# EAGLE design easyMySens-v010 (EAGLE 7.3.0)
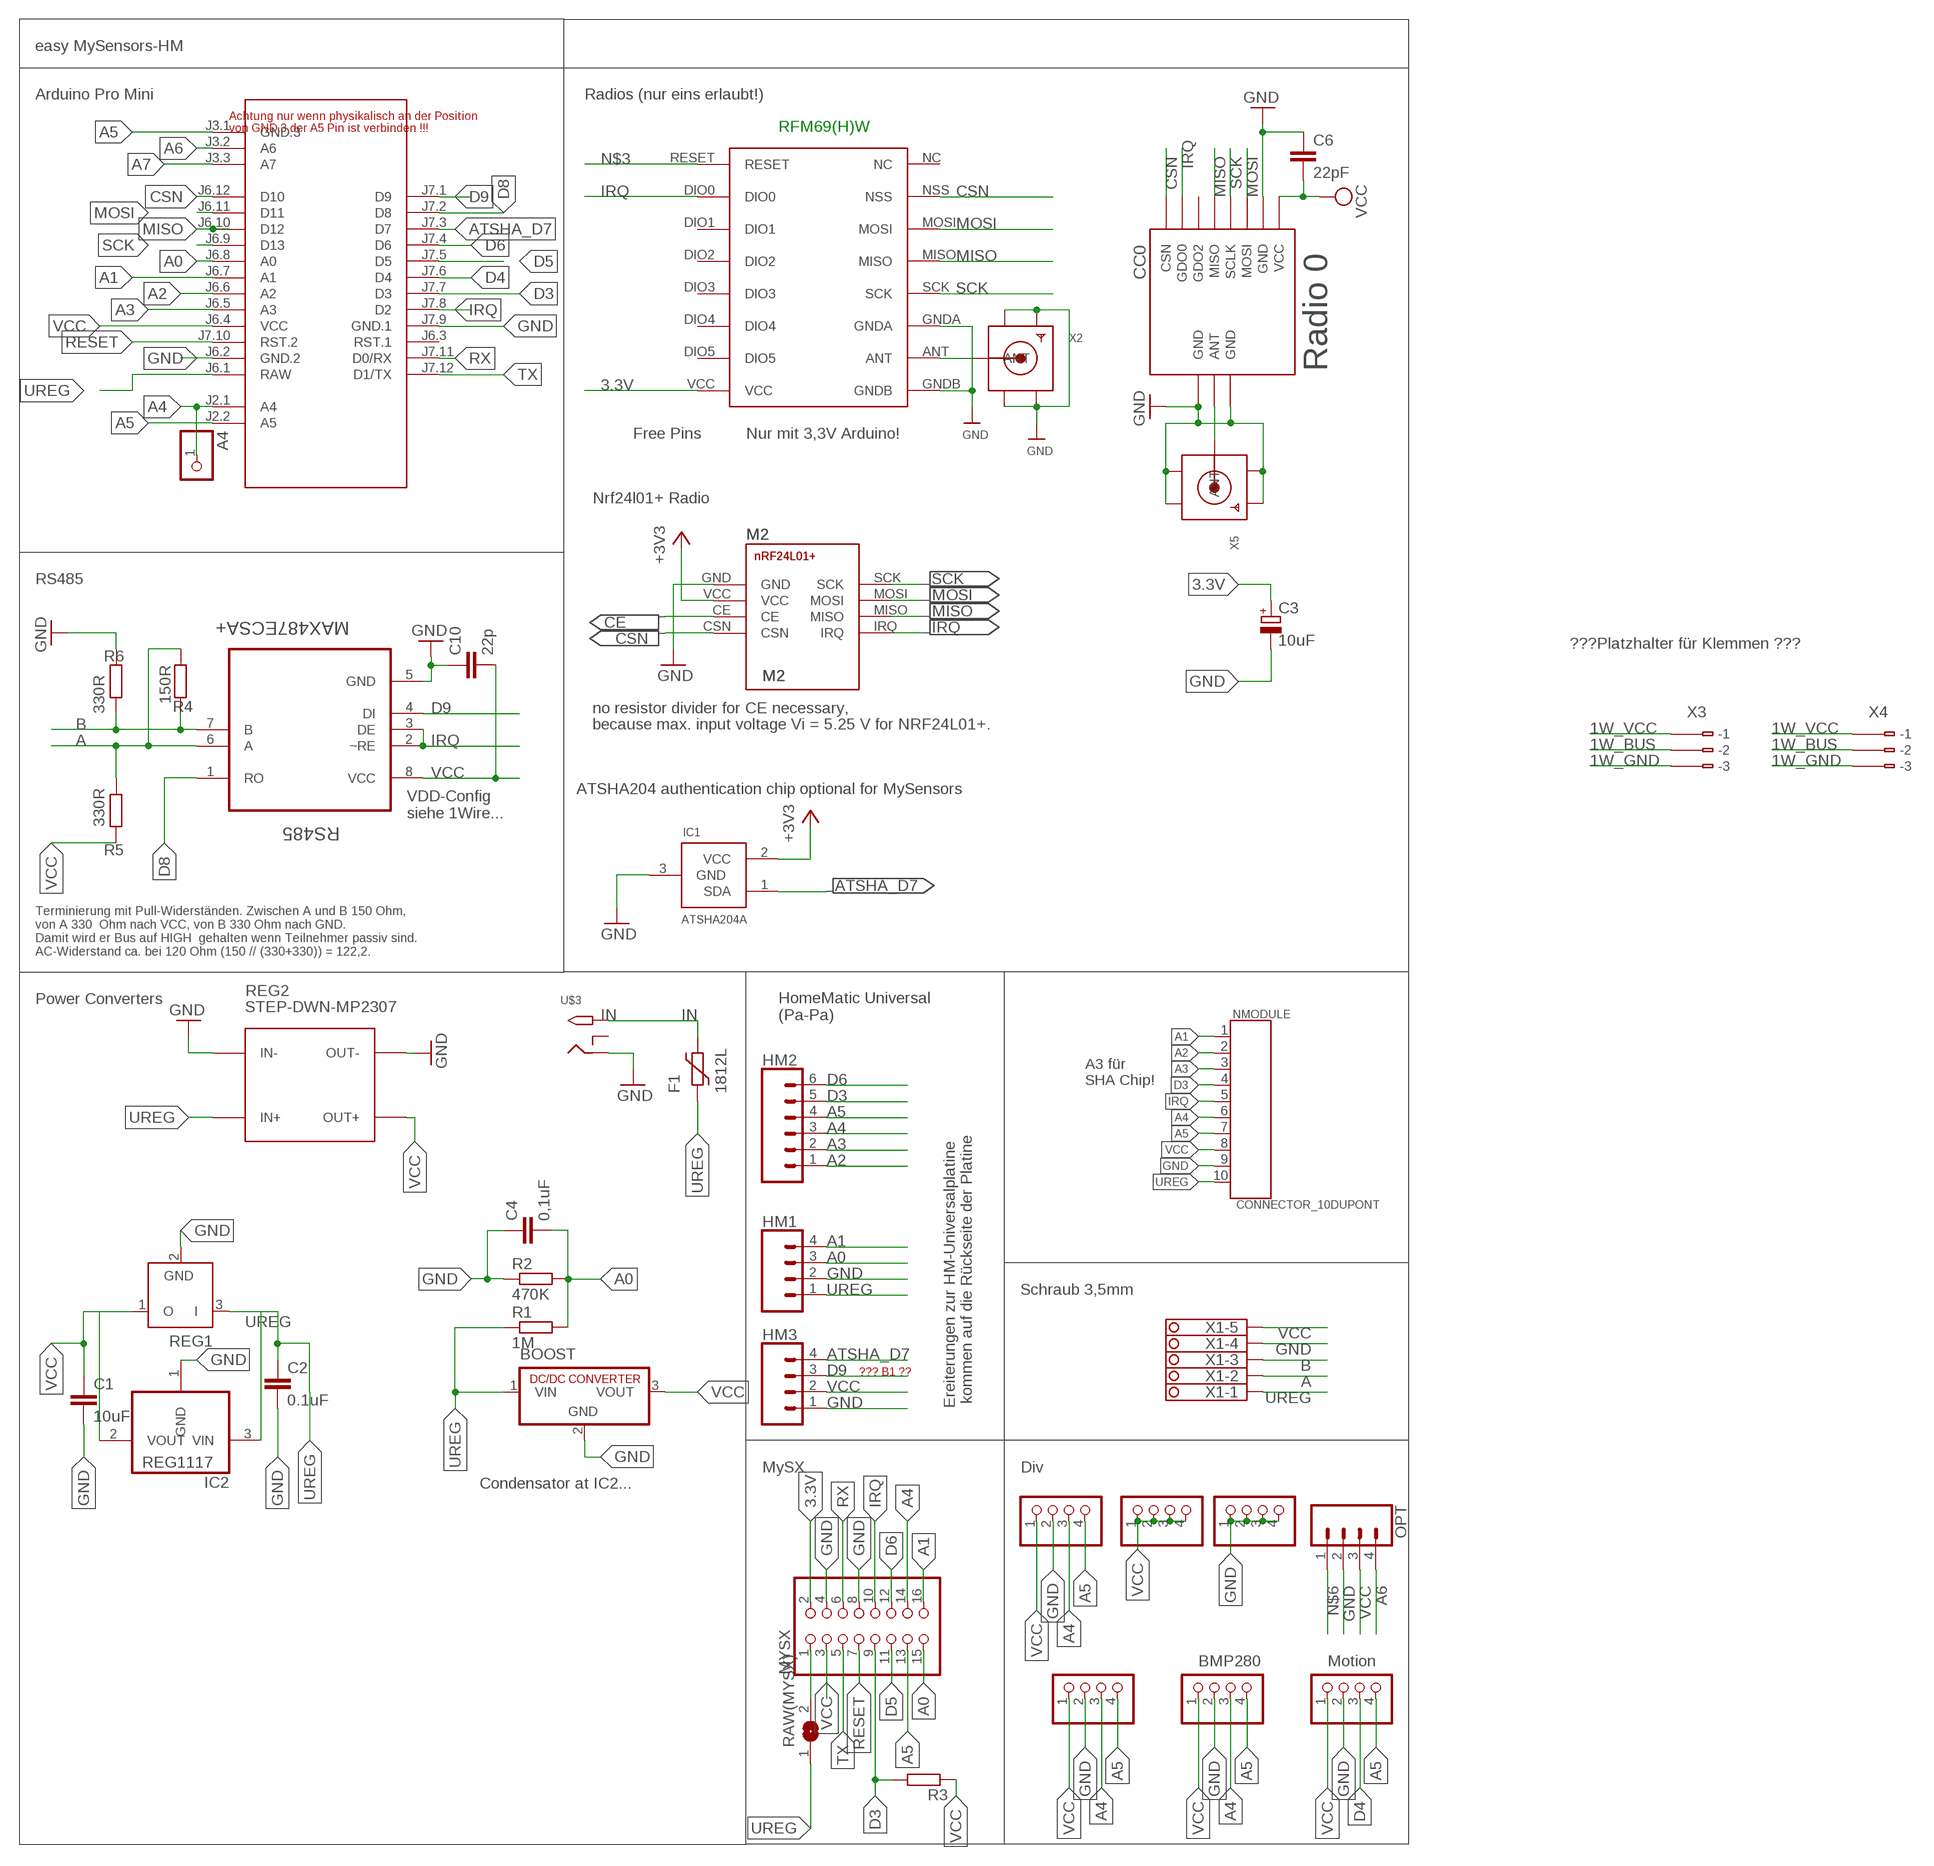
[diagram p0: schematic, sheet 1]

## Parts
A4  PINHD-1X1  [1X01]
BH1750  PINHD-1X04_2.54-S  [1X04-S]
BOOST  R-78C1.8-1.0  [SIP3]
C1  10uF  C-EUC1210  [C1210]
C2  0.1uF  C-EUC1206  [C1206]
C3  10uF  CPOL-EUSMCC  [SMC_C]
C4  0,1uF  C-EUC1206  [C1206]
C6  22pF  C-EUC0805  [C0805]
C10  22p  C-EUC0805  [C0805]
CC0  CC1101  CC1101_MODULE1SMD  [CC1101_MODULE1_SMD]
F1  1812L  [1812L]
HM1  CONN_04  [1X04]
HM2  CONN_06SILK_FEMALE_PTH  [1X06]
HM3  CONN_04  [1X04]
I2C-1  PINHD-1X04_2.54-S  [1X04-S]
I2C-2  PINHD-1X04_2.54-S  [1X04-S]
IC1  ATSHA204A  [SOT23]
IC2  REG1117  [SOT223]
JP1  PINHD-1X04_2.54-S  [1X04-S]
JP3  PINHD-1X04_2.54-S  [1X04-S]
M1  ARDUINO-PRO-MINI-3.3V#NP  [ARDUINO-PRO-MINI#NP]
M2  NRF24L01+SMD  [NRF24L01+SMD]
MOTION  PINHD-1X04_2.54-S  [1X04-S]
MYSX  PINHD-2X08_2.54  [2X08]
NMODULE  CONNECTOR_10DUPONT  [DUPONT_10]
OPT  CONN_04  [1X04]
R1  1M  R-EU_R0805  [R0805]
R2  470K  R-EU_R0805  [R0805]
R3  R-EU_R0805  [R0805]
R4  150R  R-EU_R0805  [R0805]
R5  330R  R-EU_R0805  [R0805]
R6  330R  R-EU_R0805  [R0805]
RAW(MYSX)  SJ  [SJ]
REG1  LP2950Z  [TO92]
REG2  STEP-DWN-MP2307  DC-DC-STEP-DOWN-MP2307  [DC-DC-STEP-DOWN-MP2307]
RFM69W  RFM69HW  [RFM]
RS485  MAX487ECSA+  [SOIC127P600X175-8N]
U$3  2.1MMJACKTHM  [PJ-102A]
X1  1751277  [1751277]
X2  SMACONNECTOR_EDGE  [SMA_EDGELAUNCH]
X3  CON_350-103  [CON_350-103]
X4  CON_350-103OHNE_RAND  [CON_350-103_O]
X5  SMACONNECTOR_EDGE  [SMA_EDGELAUNCH]

## Nets
1W_BUS: X3.B2(B-2) X4.B2(B-2)
1W_GND: X3.B3(B-3) X4.B3(B-3)
1W_VCC: X3.B1(B-1) X4.B1(B-1)
3.3V [Power]: C3.+ IC1.2(VCC) M2.VCC MYSX.2 RFM69W.VCC ; supply symbol labelled +3V3
A: R4.1 R5.2 RS485.6(A) X1.2
A0: C4.2 HM1.3 M1.J6.8(A0) MYSX.15 R1.2 R2.2
A1: HM1.4 M1.J6.7(A1) MYSX.16 NMODULE.1
A2: HM2.1 M1.J6.6(A2) NMODULE.2
A3: HM2.2 M1.J6.5(A3) NMODULE.3
A4: A4.1 BH1750.3 HM2.3 I2C-1.3 I2C-2.3 M1.J2.1(A4) MYSX.14 NMODULE.6
A5: BH1750.4 HM2.4 I2C-1.4 I2C-2.4 M1.J2.2(A5) M1.J3.1(GND.3) MOTION.4 MYSX.13 NMODULE.7
A6: M1.J3.2(A6) OPT.4
A7: M1.J3.3(A7)
ANT0: CC0.ANT X5.P(ANT)
ATSHA_D7: HM3.4 IC1.1(SDA) M1.J7.3(D7)
B: R4.2 R6.1 RS485.7(B) X1.3
CE: M2.CE
CSN: CC0.CSN M1.J6.12(D10) M2.CSN RFM69W.NSS
D3: HM2.5 M1.J7.7(D3) MYSX.9 NMODULE.4 R3.2
D4: M1.J7.6(D4) MOTION.3
D5: M1.J7.5(D5) MYSX.11
D6: HM2.6 M1.J7.4(D6) MYSX.12
D8: M1.J7.2(D8) RS485.1(RO)
D9: HM3.3 M1.J7.1(D9) RS485.4(DI)
GND [Power]: BH1750.2 BOOST.2(GND) C1.2 C2.2 C3.- C4.1 C6.1 C10.1 CC0.GND@0(GND) CC0.GND@1(GND) CC0.GND@2(GND) HM1.2 HM3.1 I2C-1.2 I2C-2.2 IC1.3(GND) IC2.1(GND) JP1.1 JP1.2 JP1.3 JP1.4 M1.J6.2(GND.2) M1.J7.9(GND.1) M2.GND MOTION.2 MYSX.4 MYSX.8 NMODULE.9 OPT.2 R2.1 R6.2 REG1.2(GND) REG2.IN- REG2.OUT- RFM69W.GNDA RFM69W.GNDB RS485.5(GND) U$3.RING X1.4 X2.GND@1(GND4) X2.GND@2(GND3) X2.GND@3(GND2) X2.GND@4(GND1) X5.GND@1(GND4) X5.GND@2(GND3) X5.GND@3(GND2) X5.GND@4(GND1)
IN [Power]: F1.P$2 U$3.TIP
IRQ: CC0.GDO0 M1.J7.8(D2) M2.IRQ MYSX.10 NMODULE.5 RFM69W.DIO0 RS485.2(~RE) RS485.3(DE)
MISO: CC0.MISO M1.J6.10(D12) M2.MISO RFM69W.MISO
MOSI: CC0.MOSI M1.J6.11(D11) M2.MOSI RFM69W.MOSI
N$1: MYSX.1 RAW(MYSX).2
N$3: RFM69W.RESET
N$6: OPT.1
N$16: RFM69W.ANT X2.P(ANT)
RESET: M1.J7.10(RST.2) MYSX.7
RX: M1.J7.11(D0/RX) MYSX.6
SCK: CC0.SCLK M1.J6.9(D13) M2.SCK RFM69W.SCK
TX: M1.J7.12(D1/TX) MYSX.5
UREG [Power]: BOOST.1(VIN) C2.1 F1.P$1 HM1.1 IC2.3(VIN) M1.J6.1(RAW) NMODULE.10 R1.1 RAW(MYSX).1 REG1.3(I) REG2.IN+ X1.1
VCC [Power]: BH1750.1 BOOST.3(VOUT) C1.1 C6.2 C10.2 CC0.VCC HM3.2 I2C-1.1 I2C-2.1 IC2.2(VOUT) JP3.1 JP3.2 JP3.3 JP3.4 M1.J6.4(VCC) MOTION.1 MYSX.3 NMODULE.8 OPT.3 R3.1 R5.1 REG1.1(O) REG2.OUT+ RS485.8(VCC) X1.5
Unconnected: CC0.GDO2 M1.J6.3(RST.1) RFM69W.DIO1 RFM69W.DIO2 RFM69W.DIO3 RFM69W.DIO4 RFM69W.DIO5 RFM69W.NC U$3.RING_SW X3.A1(-1) X3.A2(-2) X3.A3(-3) X4.A1(-1) X4.A2(-2) X4.A3(-3)

## Notes on the sheet
- easy MySensors-HM
- Arduino Pro Mini | Radios (nur eins erlaubt!)
- Achtung nur wenn physikalisch an der Position 
  von GND.3 der A5 Pin ist verbinden !!!
- RFM69(H)W
- Radio 0
- Free Pins | Nur mit 3,3V Arduino!
- Nrf24l01+ Radio
- RS485
- ???Platzhalter für Klemmen ???
- no resistor divider for CE necessary,
- because max. input voltage Vi = 5.25 V for NRF24L01+.
- ATSHA204 authentication chip optional for MySensors
- VDD-Config
  siehe 1Wire...
- Terminierung mit Pull-Widerständen. Zwischen A und B 150 Ohm,
  von A 330  Ohm nach VCC, von B 330 Ohm nach GND. 
  Damit wird er Bus auf HIGH  gehalten wenn Teilnehmer passiv sind.
  AC-Widerstand ca. bei 120 Ohm (150 // (330+330)) = 122,2.
- Power Converters
- HomeMatic Universal
  (Pa-Pa)
- A3 für 
  SHA Chip!
- Schraub 3,5mm
- ??? B1 ??
- Ereiterungen zur HM-Universalplatine
   kommen auf die Rückseite der Platine
- MySX | Div
- Condensator at IC2...
- BMP280 | Motion

## Library data of the parts
A4 = pinhead:PINHD-1X1: PIN HEADER
BH1750 I2C-1 I2C-2 JP1 JP3 MOTION = pinhead-2:PINHD-1X04: PIN HEADER
BOOST = dc-dc-converter:R-78C*-1.0: INNOLINE DC/DC-Converter 1.0 AMP SIP3 Single Output Source: Data sheet <http://www.mikrocontroller.net/attachment/150645/157764-da-01-en-DC_DC_WANDLER_R_78C5_0_1_0.pdf>
C1 C2 C4 C6 C10 = rcl:C-EU: CAPACITOR, European symbol
C3 = rcl:CPOL-EU: POLARIZED CAPACITOR, European symbol
CC0 = wireless:CC1101_MODULE1: CC1101 wireless module for 433/868 MHz (sold from Aliexpress). DIL version for mounting with pin header (and SMD soldering) and SMD only variant available.
F1 = ptc-littlefuse:1812L
HM1 HM3 OPT = SparkFun-Connectors:CONN_04: Multi connection point. Often used as Generic Header-pin footprint for 0.1 inch spaced/style header connections On any of the 0.1 inch spaced packages, you can populate with these: Break Away Headers - Straight <https://www.sparkfun.com/products/116> (PRT-00116) Break Away Male Headers - Right Angle <https://www.sparkfun.com/products/553> (PRT-00553) Female Headers <https://www.sparkfun.com/products/115> (PRT-00115) Break Away Headers - Machine Pin <https://www.sparkfun.com/products/117> (PRT-00117) Break Away Female Headers - Swiss Machine Pin <https://www.sparkfun.com/products/743> (PRT-00743) For SCREWTERMINALS and SPRING TERMINALS visit here: Screw Terimnals on SparkFun.com <https://www.sparkfun.com/search/results?term=Screw+Terminals> (5mm/3.5mm/2.54mm spacing) This device is also useful as a general connection point to wire up your design to another part of your project. Our various solder wires solder well into these plated through hole pads. Hook-Up Wire - Assortment (Stranded, 22 AWG) <https://www.sparkfun.com/products/11375> (PRT-11375) Hook-Up Wire - Assortment (Solid Core, 22 AWG) <https://www.sparkfun.com/products/11367> (PRT-11367) View the entire wire category on our website here <https://www.sparkfun.com/categories/141> Special notes: Molex polarized connector foot print use with SKU : PRT-08231 with associated crimp pins and housings. 1MM SMD Version SKU: PRT-10208; PROD_ID: CONN-09696
HM2 = SparkFun-Connectors:CONN_06: Multi connection point. Often used as Generic Header-pin footprint for 0.1 inch spaced/style header connections On any of the 0.1 inch spaced packages, you can populate with these: Break Away Headers - Straight <https://www.sparkfun.com/products/116> (PRT-00116) Break Away Male Headers - Right Angle <https://www.sparkfun.com/products/553> (PRT-00553) Female Headers <https://www.sparkfun.com/products/115> (PRT-00115) Break Away Headers - Machine Pin <https://www.sparkfun.com/products/117> (PRT-00117) Break Away Female Headers - Swiss Machine Pin <https://www.sparkfun.com/products/743> (PRT-00743) Arduino Stackable Header - 6 Pin <https://www.sparkfun.com/products/9280> (PRT-09280) For SCREWTERMINALS and SPRING TERMINALS visit here: Screw Terimnals on SparkFun.com <https://www.sparkfun.com/search/results?term=Screw+Terminals> (5mm/3.5mm/2.54mm spacing) This device is also useful as a general connection point to wire up your design to another part of your project. Our various solder wires solder well into these plated through hole pads. Hook-Up Wire - Assortment (Stranded, 22 AWG) <https://www.sparkfun.com/products/11375> (PRT-11375) Hook-Up Wire - Assortment (Solid Core, 22 AWG) <https://www.sparkfun.com/products/11367> (PRT-11367) View the entire wire category on our website here <https://www.sparkfun.com/categories/141>; PROD_ID: CONN-08437
IC1 = Sensor:ATSHA204A
IC2 = burr-brown:REG1117: 800mA and 1A Low Dropout (LDO) Positive Regulator 1.8V, 2.5V, 2.85V, 3.3V, 5V, and Adj; MPN: REG1117; OC_FARNELL: 1097566; OC_NEWARK: 14P6981
M1 = diy-modules:ARDUINO-PRO-MINI-*#NP: Arduino Pro Mini without programming pads
M2 = wireless:NRF24L01+: nRF24L01+ Transceiver Module
MYSX = pinhead-2:PINHD-2X08: PIN HEADER
NMODULE = TD-MySensors:CONNECTOR_10
R1-R6 = rcl:R-EU_: RESISTOR, European symbol
RAW(MYSX) = jumper:SJ: SMD solder JUMPER
REG1 = linear:LP2950: 100 mA, Low Power Low Dropout Voltage Regulator Source: http://www.onsemi.com/pub/Collateral/LP2950-D.PDF
REG2 = diy-modules:DC-DC-STEP-DOWN-MP2307: DC/DC Step-Down Regulator based on MP2307DN chip MP2307 datasheet available here: https://cdn-shop.adafruit.com/datasheets/MP2307_r1.9.pdf Click here to find device on ebay.com <http://www.ebay.com/sch/dc+dc+3a+mini+converter>
RFM69W = hoperf:RFM69HW
RS485 = Maxim_By_element14_Batch_1:MAX487ECSA+: Low-Power, Slew-Rate-Limited RS-485/RS-422 Transceivers; MPN: MAX487ECSA+; OC_FARNELL: 9724532; OC_NEWARK: 68K4803; PACKAGE: SOIC-8; SUPPLIER: Maxim
U$3 = adafruit:2.1MMJACK: 2.1mm x 5.5mm THM DC jack with internal switch. Digikey part #PJ-102A, 4UCON part #05537 2.1mm x 5.5mm SMT DC jack with internal switch. Digikey part #PJ-002A-SMT, 4UCON part #03267 By microbuilder.eu & adafruit.com
X1 = con-phoenix-350:1751277: MKDS 1/ 5-3,5 Printklemme Nennstrom: 10 A Bemessungsspannung: 160 V Raster: 3,5 mm Polzahl: 5 Montageart: Löten Anschlussart: Schraubanschluss Anschlussrichtung vom Leiter zur Platine: 0° Source: http://eshop.phoenixcontact.com .. 1751277.pdf; OC_FARNELL: unknown; OC_NEWARK: unknown
X2 X5 = adafruit:SMACONNECTOR: SMA Connector 90° DIP SMA Connector, 50 Ohm (4UConnector: 07259)
X3 = my:CON_350-103: KF250-3.5 3p; MPN: 233-103; OC_FARNELL: unknown; OC_NEWARK: 28K9045
X4 = my:CON_350-103: KF250-3.5 3p

## Net classes
0 default: width 0.305 mm
1 Power: width 0.508 mm

## Board
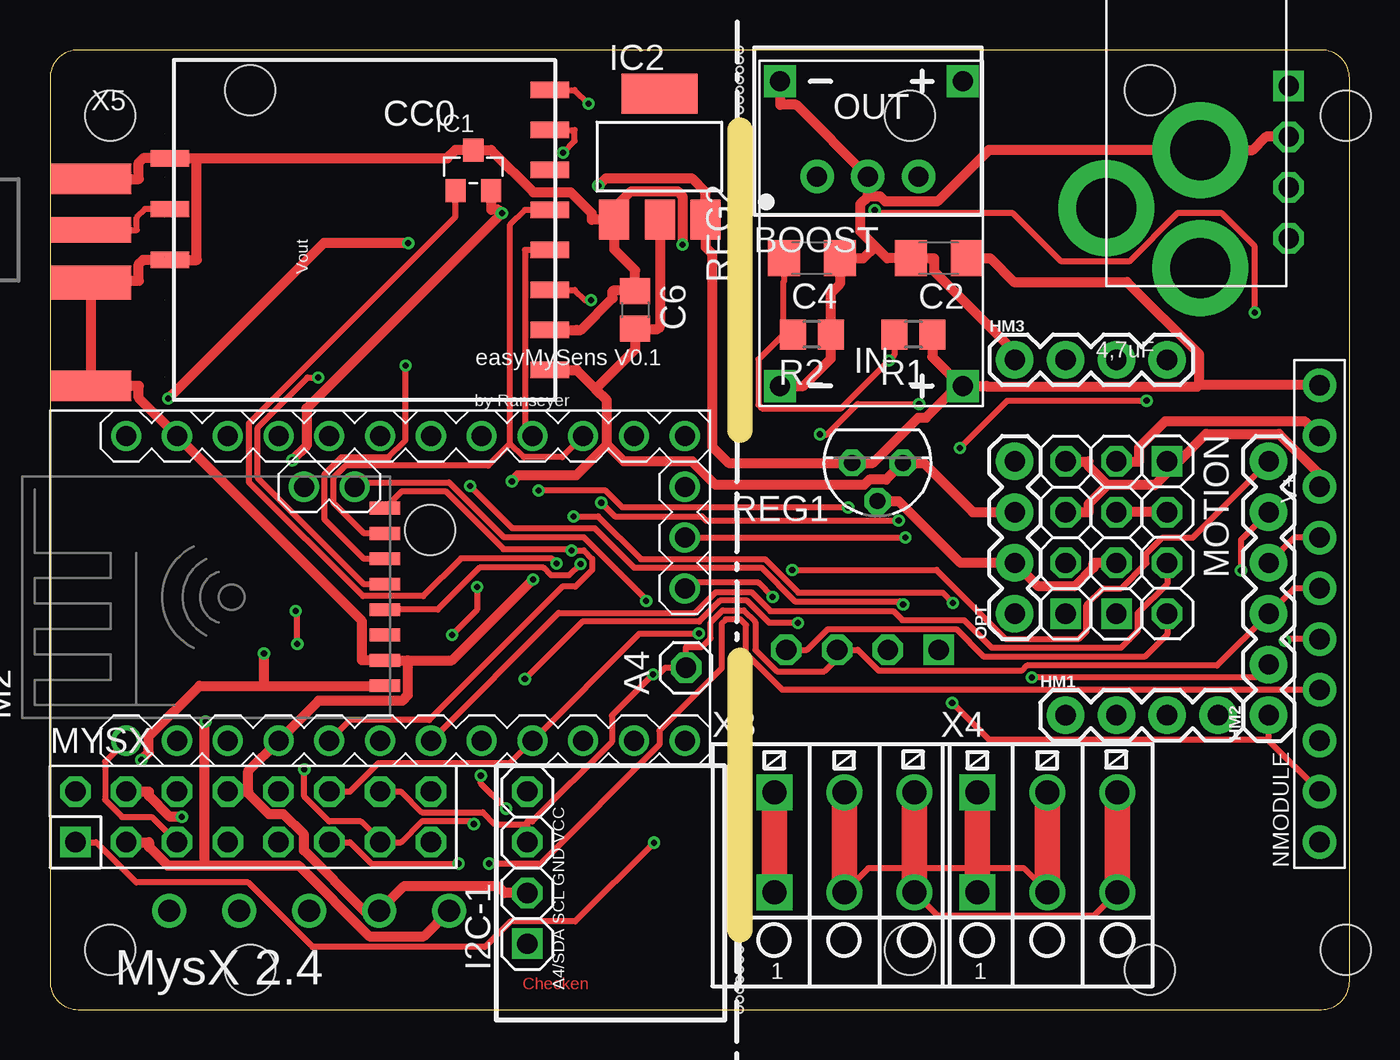
[diagram p1: board, top side]
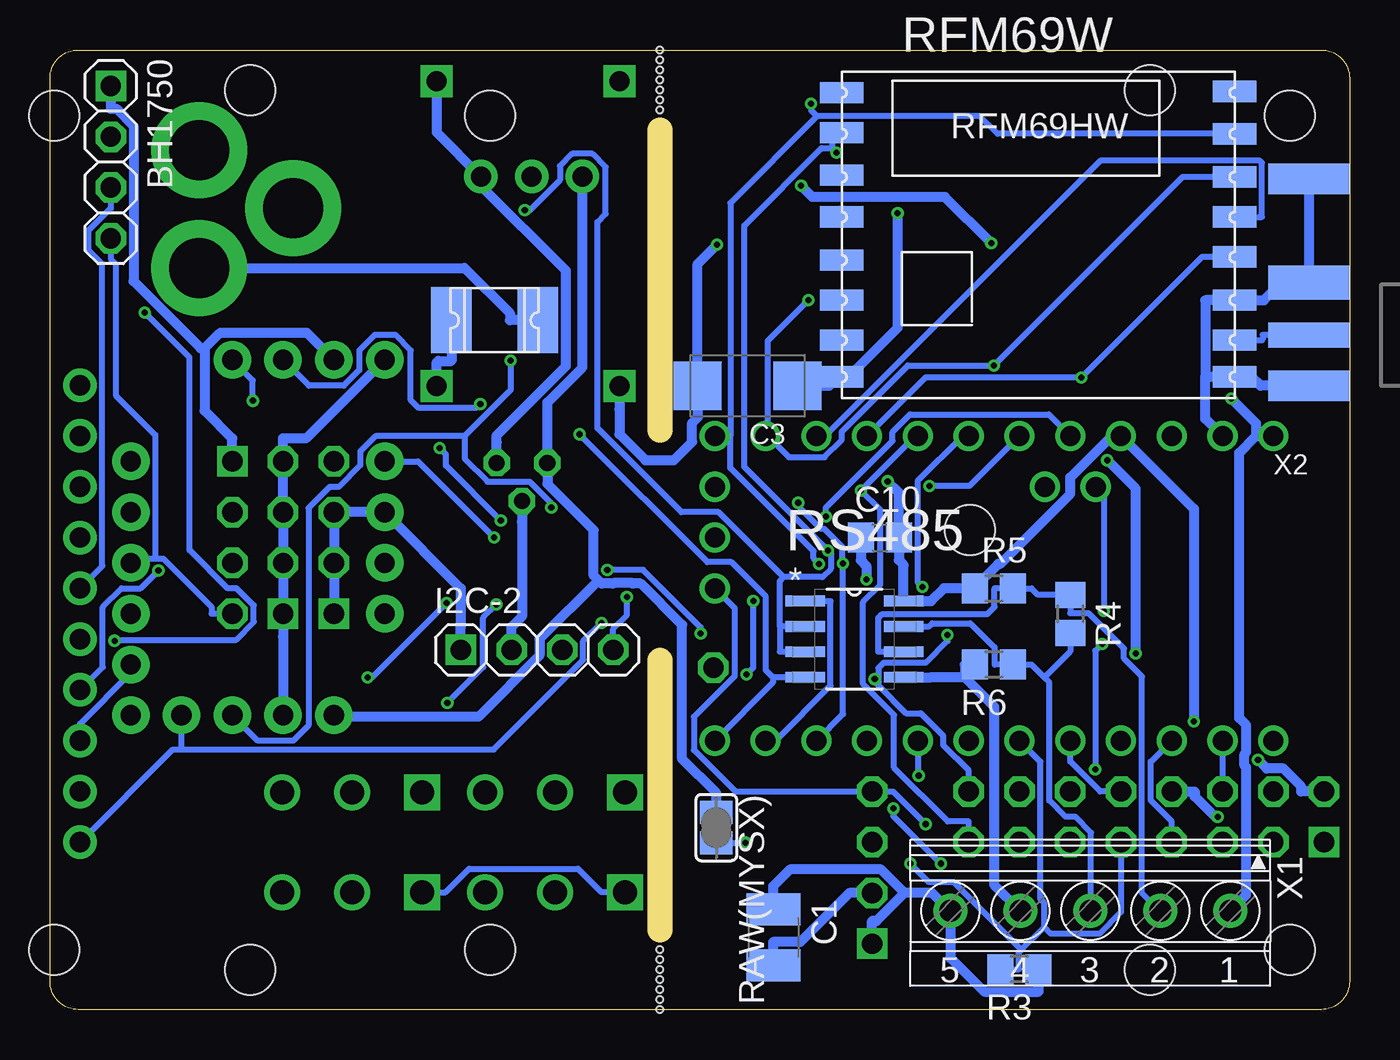
[diagram p2: board, bottom side, seen from below]

Size 65 x 48 mm. Coordinates in mm from the lower left corner, seen from the top.
Outline: 0,46.59 0,1.41 arc90 1.41,0 63.59,0 arc90 65,1.41 65,46.59 arc90 63.59,48 1.41,48 arc90 0,46.59
Copper layers (1*16): Top 0.035mm / dielectric 1.5mm / Bottom 0.035mm
Design rules "dirt_cheap_dirty_boards.v1": minimum track width 5mil, minimum drill 12mil, track to track 5mil, track to pad 5mil, pad to pad 5mil, via to via 5mil, smd to smd 0mil, copper to edge 10mil, drill to drill 10mil, minimum pad ring 10mil, minimum via ring 6mil, stop-mask expansion 2mil, vias tented up to drill 25mil, thermal gap 10mil
Holes 2.5 mm at 19,24 3,3 3,44.7 64.8,44.7 43,3 64.8,3 43,44.7 10,2 55,2 10,46 55,46
Holes 0.3 mm at 34.5,3 34.5,2.5 34.5,2 34.5,1.5 34.5,1 34.5,0.5 34.5,45 34.5,45.5 34.5,46 34.5,46.5 34.5,47 34.5,47.5 34.5,48 34.5,0
tRestrict: 20 lines
bRestrict: 19 lines
Milling: 2 lines

### Footprints (pad centres in the part's own frame; a part is rotated, then mirrored left to right if it is on the bottom)
1X01 = drill 1.016 octagon: 1 0,0
1X04-S = drill 1.016 square: 1 -3.81,0 | drill 1.016 octagon: 2 -1.27,0; 3 1.27,0; 4 3.81,0
SIP3 = drill 1 pad 1.676: 1 -2.54,0; 2 0,0; 3 2.54,0
C1210 = smd 1.6 x 2.7: 1 -1.4,0; 2 1.4,0
C1206 = smd 1.6 x 1.8: 1 -1.4,0; 2 1.4,0
SMC_C = smd 2.4 x 2.4: + -2.5,0; - 2.5,0
C0805 = smd 1.3 x 1.5: 1 -0.95,0; 2 0.95,0
CC1101_MODULE1_SMD = smd 1.93 x 0.813: ANT 19,5.96; CSN 0,0; GDO0 0,2; GDO2 0,4; GND@0 0,12; GND@1 19,8.5; GND@2 19,3.42; MISO 0,6; MOSI 0,10; SCLK 0,8; VCC 0,14
1812L = smd 2.03 x 3.3: P$1 -2.16,0; P$2 2.16,0
1X04 = drill 1.016 pad 1.88: 1 0,0; 2 2.54,0; 3 5.08,0; 4 7.62,0
1X06 = drill 1.016 pad 1.88: 1 0,0; 2 2.54,0; 3 5.08,0; 4 7.62,0; 5 10.16,0; 6 12.7,0
SOT23 = smd 1.016 x 1.143: 1 -0.889,-1.016; 2 0.889,-1.016; 3 0,1.016
SOT223 = smd 1.499 x 2.007: 1 -2.261,-3.15; 2 0.025,-3.15; 3 2.311,-3.15 | smd 3.81 x 2.007: 4 0,3.15
ARDUINO-PRO-MINI#NP = drill 1: J2.1 -1.27,5.08; J2.2 -3.81,5.08; J3.1 15.24,0; J3.2 15.24,2.54; J3.3 15.24,5.08; J6.1 -12.7,7.62; J6.2 -10.16,7.62; J6.3 -7.62,7.62; J6.4 -5.08,7.62; J6.5 -2.54,7.62; J6.6 0,7.62; J6.7 2.54,7.62; J6.8 5.08,7.62; J6.9 7.62,7.62; J6.10 10.16,7.62; J6.11 12.7,7.62; J6.12 15.24,7.62; J7.1 15.24,-7.62; J7.2 12.7,-7.62; J7.3 10.16,-7.62; J7.4 7.62,-7.62; J7.5 5.08,-7.62; J7.6 2.54,-7.62; J7.7 0,-7.62; J7.8 -2.54,-7.62; J7.9 -5.08,-7.62; J7.10 -7.62,-7.62; J7.11 -10.16,-7.62; J7.12 -12.7,-7.62
NRF24L01+SMD = smd 0.635 x 1.524: CE -1.575,-7.861; CSN -0.305,-7.861; GND -2.845,-7.861; IRQ 4.775,-7.861; MISO 3.505,-7.861; MOSI 2.235,-7.861; SCK 0.965,-7.861; VCC -4.115,-7.861
2X08 = drill 1.016 square: 1 -8.89,-1.27 | drill 1.016 octagon: 2 -8.89,1.27; 3 -6.35,-1.27; 4 -6.35,1.27; 5 -3.81,-1.27; 6 -3.81,1.27; 7 -1.27,-1.27; 8 -1.27,1.27; 9 1.27,-1.27; 10 1.27,1.27; 11 3.81,-1.27; 12 3.81,1.27; 13 6.35,-1.27; 14 6.35,1.27; 15 8.89,-1.27; 16 8.89,1.27
DUPONT_10 = drill 1.016 pad 1.676: 1 1.27,1.27; 2 3.81,1.27; 3 6.35,1.27; 4 8.89,1.27; 5 11.43,1.27; 6 13.97,1.27; 7 16.51,1.27; 8 19.05,1.27; 9 21.59,1.27; 10 24.13,1.27
R0805 = smd 1.3 x 1.5: 1 -0.95,0; 2 0.95,0
SJ = smd 1.168 x 1.6: 1 -0.762,0; 2 0.762,0
TO92 = drill 0.813 octagon: 1 -1.27,0; 2 0,1.905; 3 1.27,0
DC-DC-STEP-DOWN-MP2307 = drill 1 pad 1.6 square: IN+ -7.62,-4.572; IN- -7.62,4.572; OUT+ 7.62,-4.572; OUT- 7.62,4.572
RFM = smd 2.184 x 1.067: ANT 19.651,2.889; DIO0 0,13.27; DIO1 0,11.143; DIO2 0,9.047; DIO3 0,6.889; DIO4 0,4.889; DIO5 0,2.889; GNDA 19.651,4.889; GNDB 19.651,1.048; MISO 19.651,9.047; MOSI 19.651,11.047; NC 19.651,15.334; NSS 19.651,13.206; RESET 0,15.27; SCK 19.651,7.048; VCC 0,1.048
SOIC127P600X175-8N = smd 1.981 x 0.533: 1 -2.464,1.905; 2 -2.464,0.635; 3 -2.464,-0.635; 4 -2.464,-1.905; 5 2.464,-1.905; 6 2.464,-0.635; 7 2.464,0.635; 8 2.464,1.905
PJ-102A = drill 3 pad 4.8: RING 0.1,-3.39; RING_SW -4.6,-6.29; TIP 0.1,-9.29
1751277 = drill 1.1 pad 1.7: 1 -7,-0.1; 2 -3.5,-0.1; 3 0,-0.1; 4 3.5,-0.1; 5 7,-0.1
SMA_EDGELAUNCH = smd 4.064 x 1.524: GND@1 2.032,-2.54; GND@2 2.032,2.54 | smd 4.064 x 1.524 bottom: GND@3 2.032,2.54; GND@4 2.032,-2.54 | smd 4.064 x 1.27: P 2.032,0
CON_350-103 = drill 1.2 square: A1 -2.5,2.5; B1 -2.5,-2.5 | drill 1.2: A2 1,2.5; A3 4.5,2.5; B2 1,-2.5; B3 4.5,-2.5
CON_350-103_O = drill 1.2 square: A1 -2.5,2.5; B1 -2.5,-2.5 | drill 1.2: A2 1,2.5; A3 4.5,2.5; B2 1,-2.5; B3 4.5,-2.5

### Placement (x,y rotation side)
A4  31.82,17.1 90 top
BH1750  61.96,42.39 270 bottom
BOOST  40.91,41.67 0 top
C1  28.81,3.6 270 bottom
C2  44.45,37.58 180 top
C3  30.11,31.2 180 bottom
C4  38.1,37.58 180 top
C6  29.27,35 270 top
C10  23.5,23.61 0 bottom
CC0  25,46 180 top
F1  42.76,34.48 0 bottom
HM1  50.8,14.72 0 top
HM2  60.96,14.72 90 top
HM3  48.26,32.5 0 top
I2C-1  23.88,7.1 90 top
I2C-2  40.64,17.99 0 bottom
IC1  21.18,41.97 0 top
IC2  30.48,42.66 0 top
JP1  53.34,23.61 90 top
JP3  50.8,23.61 90 top
M1  16.51,21.07 0 top
M2  8.89,20.31 90 top
MOTION  55.88,23.61 270 top
MYSX  10.16,9.64 0 top
NMODULE  64.77,7.1 90 top
OPT  48.26,19.8 90 top
R1  43.18,33.77 180 top
R2  38.1,33.77 180 top
R3  16.51,2.02 180 bottom
R4  13.97,19.8 270 bottom
R5  17.78,21.07 0 bottom
R6  17.78,17.26 180 bottom
RAW(MYSX)  31.68,9.1 270 bottom
REG1  41.39,27.34 180 top
REG2  41.09,38.81 90 top
RFM69W  25.4,30.59 0 bottom
RS485  24.77,18.53 0 bottom
U$3  57.44,46.39 0 top
X1  12.97,4.83 180 bottom
X2  0,33.74 180 bottom
X3  38.73,8.37 0 top
X4  48.9,8.37 0 top
X5  0,39 0 top

### Tracks (layer width: path | path; a pad name or v marks a point on that pad's centre or on a via)
1W_BUS
  Top 0.305: X4.B2 48.7,7.06 40.93,7.06 X3.B2
1W_GND
  Top 0.305: X4.B3 52.22,4.69 44.41,4.69 X3.B3
1W_VCC
  Bottom 0.305: X3.B1 37.41,5.87 38.59,7.05 44.04,7.05 45.22,5.87 X4.B1
3.3V  (via drill 0.3 pad 0.61)
  Top 0.508: 10.7,16.19 M2.VCC | v4.57,12.49 4.95,12.86 4.95,13.65 7.49,16.19 10.7,16.19 | v10.7,17.81 10.7,16.19 | v12.12,27.48 12.84,28.19 12.84,30.07 v22.61,39.84 22.43,40.01 22.06,40.01 IC1.2
  Bottom 0.508: C3.+ 26.03,31.2 25.58,31.64 RFM69W.VCC 25.06,31.64 22.61,34.1 v22.61,39.84 | MYSX.2 2.41,10.91 2.41,11.16 3.31,12.05 4.14,12.05 v4.57,12.49 | v10.7,17.81 10.7,26.05 v12.12,27.48
A
  Bottom 0.305: X1.2 10.38,5.84 10.38,16.66 11.28,17.56 11.28,18.06 13.04,19.82 13.97,19.82 R4.1 15,20.75 15.58,20.75 15.9,21.07 R5.2 17.07,21.07 17.76,21.07 17.76,20.14 18.12,19.78 23.39,19.78 23.57,19.59 23.57,17.9 RS485.6
A0  (via drill 0.3 pad 0.61)
  Top 0.305: v39.92,25.12 28.64,25.12 27.79,25.96 v24.43,25.96 | 36.69,33.77 35.43,32.52 35.43,30.26 35.62,30.07 39.56,30.07 v41.96,32.47 42.23,32.74 R1.2 | 36.69,33.77 36.69,36.39 36.7,36.4 C4.2 | R2.2 36.69,33.77
  Bottom 0.305: 44.26,28.68 48.72,28.68 49.48,27.92 49.48,27.22 50.55,26.15 51.01,26.15 52.07,25.09 52.07,14.21 52.83,13.45 54.61,13.45 HM1.3 | v41.96,32.47 41.96,30.99 44.26,28.68 | 44.26,28.68 44.26,27.55 43.12,26.4 41,26.4 39.92,25.32 v39.92,25.12 | M1.J6.8 21.7,28.69 v24.43,25.96 23.48,25 23.48,21.24 24.34,20.38 24.34,16.29 22.78,14.73 22.78,12.1 20.09,9.41 19.05,9.41 MYSX.15
A1  (via drill 0.3 pad 0.61)
  Top 0.305: v37.41,19.34 35.98,19.34 34.87,20.45 33.52,20.45 32.47,19.41 26.63,19.41 v23.75,16.53 | v21.36,21.14 21.36,19.99 v20.11,18.74
  Bottom 0.305: 58.42,13.01 42.81,13.01 38.33,17.49 38.33,18.43 v37.41,19.34 | M1.J6.7 19.34,28.69 21.6,26.43 21.6,21.38 v21.36,21.14 | 58.42,13.01 HM1.4 | NMODULE.1 58.86,13.01 58.42,13.01 | 23.57,16.53 23.57,16.21 22.19,14.82 21.44,14.82 20.33,13.71 20.33,13.23 19.05,11.95 MYSX.16 | v20.11,18.74 20.11,18.43 21.2,17.35 23.31,17.35 23.57,17.09 23.57,16.53 | v23.75,16.53 23.57,16.53
A2  (via drill 0.3 pad 0.61)
  Top 0.305: v21.01,26.19 23.12,24.08 27.25,24.08 29.22,22.1 35.58,22.1 37.26,20.42 42.51,20.42 v42.67,20.26 | 60.96,13.48 46.99,13.48 v45.13,15.34 | NMODULE.2 60.96,13.45 60.96,13.48 | 60.96,13.48 HM2.1
  Bottom 0.305: v45.13,15.34 43.33,17.13 43.33,19.6 v42.67,20.26 | M1.J6.6 19.01,26.19 v21.01,26.19
A3  (via drill 0.3 pad 0.61)
  Top 0.305: v26.19,24.67 27.43,24.67 29.55,22.53 35.76,22.53 37.44,20.85 44.65,20.85 v45.16,20.34 | HM2.2 60.32,16.62 v49.11,16.62
  Bottom 0.305: v45.16,20.34 48.89,16.62 v49.11,16.62 | v26.19,24.67 26.19,25.11 22.86,28.44 22.86,28.89 21.98,29.77 15.05,29.77 M1.J6.5 | NMODULE.3 63.5,14.29 60.96,16.83 HM2.2
A4  (via drill 0.3 pad 0.61)
  Top 0.305: 39.8,17.99 38.73,16.92 36.35,16.92 35.28,17.99 35.28,19.38 34.7,19.97 33.64,19.97 33.04,19.37 33.04,18.56 32.62,18.14 31.82,18.14 A4.1 30.77,17.1 30.44,16.77 v30.16,16.77 28.1,14.71 28.1,13.4 24.12,9.41 23.88,9.41 23.88,9.27 | M1.J2.1 15.46,26.37 19.96,26.37 22.69,23.64 26.7,23.64 29.82,20.51 v29.82,20.44 | MYSX.14 17.55,10.91 18.59,9.87 21.65,9.87 22.25,9.27 23.88,9.27 | I2C-1.3 23.88,9.27 | NMODULE.6 62.23,21.07 HM2.3 58.36,17.2 48.87,17.2 48.61,16.94 41.46,16.94 40.41,17.99 39.89,17.99 39.8,17.99 | I2C-2.3 39.8,17.99
  Bottom 0.305: v30.16,16.77 29.82,17.11 v29.82,20.44 | BH1750.3 61.96,40.08 63.05,38.98 63.05,37.97 62.38,37.29 62.38,22.19 NMODULE.6
A5  (via drill 0.3 pad 0.61)
  Top 0.305: 16.59,8.37 15.55,9.41 13.97,9.41 12.72,10.66 v12.72,12.02 | v12.37,18.29 12.37,19.86 v12.29,19.94 | 16.59,8.37 16.68,8.37 16.77,8.37 17.55,8.37 18.62,9.44 21.04,9.44 v21.2,9.28 | MYSX.13 16.59,8.37 | v36.15,20.64 35.43,21.36 32.04,21.36 M1.J3.1 | I2C-2.4 37.87,17.99 38.91,19.03 45.33,19.03 46.69,17.67 54.8,17.67 55.88,18.76 MOTION.4 | NMODULE.7 62.23,23.61 HM2.4
  Bottom 0.305: M1.J3.1 30.76,20.08 30.76,16.67 32.79,14.64 32.79,12.98 30.72,10.91 I2C-1.4 22.83,10.91 v21.2,9.28 | v12.37,18.29 12.72,17.94 v12.72,12.02 | M1.J2.2 12.29,25.74 v12.29,19.94 | I2C-2.4 36.83,19.03 36.15,19.72 v36.15,20.64 | 59.73,22.55 59.33,22.55 56.92,20.14 56.92,19.8 MOTION.4 | HM2.4 60.75,22.55 59.73,22.55 | 59.73,22.55 59.73,28.74 61.7,30.71 61.7,37.28 61.96,37.54 BH1750.4
A6  (via drill 0.3 pad 0.61)
  Top 0.305: M1.J3.2 v42.79,23.61
  Bottom 0.305: OPT.4 46.6,27.42 v42.79,23.61
ANT0
  Top 0.305: X5.P 4.34,39 4.34,39.63 4.75,40.04 CC0.ANT
ATSHA_D7  (via drill 0.3 pad 0.61)
  Top 0.305: v27.57,25.35 28.26,24.67 32.61,24.67 32.82,24.46 v42.45,24.46 | v45.51,28.09 47.88,30.45 v54.85,30.45 | v25.34,22.31 25.09,22.57 20.56,22.57 18.67,20.68 15.66,20.68 9.96,26.37 9.96,29.33 20.29,39.66 IC1.1
  Bottom 0.305: v27.57,25.35 27.57,25.17 26.44,24.04 26.27,24.04 25.38,23.15 25.38,22.35 v25.34,22.31 25.34,14.78 M1.J7.3 | v42.45,24.46 45.19,27.2 45.19,27.77 | 45.19,27.77 | 45.19,27.77 v45.51,28.09 | v54.85,30.45 54.85,31.47 HM3.4
B
  Bottom 0.305: 15.27,16.62 15.9,17.26 R6.1 17.76,17.26 17.76,18.12 18.97,19.32 20.87,19.32 21.03,19.16 RS485.7 | X1.3 12.93,4.97 12.93,8.84 13.72,9.64 14.21,9.64 15.02,10.45 15.02,16.38 15.27,16.62 | 15.27,16.62 13.97,17.92 R4.2
CSN  (via drill 0.3 pad 0.61)  (1 unrouted)
  Top 0.305: v26.53,22.3 25.95,21.71 25.07,21.71 24.68,22.1 21.5,22.1 19.39,20 M2.CSN | v26.94,45.31 26.25,46 CC0.CSN
  Bottom 0.305: v26.53,22.3 26.81,22.57 26.81,22.93 30.97,27.09 30.97,28.69 | 26.64,44.68 30.97,40.35 30.97,28.69 | 30.97,28.69 M1.J6.12 | RFM69W.NSS 17.6,43.8 18.48,44.68 26.64,44.68 | v26.94,45.31 26.94,44.98 26.64,44.68
D3  (via drill 0.3 pad 0.61)
  Top 0.305: NMODULE.4 36.63,15.99 34.81,17.8 34.81,19.23 34.53,19.52 33.8,19.52 33.59,19.31 33.59,17.07 30.48,13.96 30.48,13.25 24.52,7.3 v21.96,7.3 | HM2.5 59.57,23.49 v59.57,21.97
  Bottom 0.305: 16.4,2.99 19.79,6.37 21.03,6.37 v21.96,7.3 | 16.4,2.99 15.27,4.12 | 16.4,2.99 16.53,2.86 16.53,2.02 R3.2 | 15.27,4.12 15.27,5.33 15.45,5.51 15.45,12.39 M1.J7.7 | 15.27,4.12 14.95,3.8 12.49,3.8 11.43,4.86 11.43,7.33 MYSX.9 | NMODULE.4 62.36,17.13 62.36,20.13 61.42,21.07 60.47,21.07 v59.57,21.97
D4
  Top 0.305: M1.J7.6 25.44,19.84 32.27,19.84 33.31,20.88 35.08,20.88 36.03,19.93 42.18,19.93 42.62,19.48 45.72,19.48 47.09,18.11 53.58,18.11 54.41,18.94 54.41,19.83 55.88,21.3 MOTION.3
D5  (via drill 0.3 pad 0.61)
  Top 0.305: MYSX.11 15.01,8.37 16.08,7.3 v20.44,7.3 | v22.82,10.05 21.55,11.32 v21.55,11.7
  Bottom 0.305: v22.82,10.05 22.82,9.67 v20.44,7.3 | M1.J7.5 21.59,11.74 v21.55,11.7
D6  (via drill 0.3 pad 0.61)
  Top 0.305: v37.12,21.99 44.34,21.99 47.8,18.54 51.47,18.54 51.84,18.91 51.84,20.23 52.69,21.07 53.58,21.07 54.84,22.33 54.84,22.81 55.63,23.61 57.15,23.61 HM2.6 | v32.45,18.81 29.49,18.81 M1.J7.4 23.01,12.33 16.43,12.33 15.01,10.91 MYSX.12
  Bottom 0.305: v32.45,18.81 32.45,19.12 35.33,21.99 v37.12,21.99
D8
  Bottom 0.305: M1.J7.2 28.72,13.45 25.96,16.21 25.96,20.44 RS485.1
D9  (via drill 0.3 pad 0.61)
  Top 0.305: v38.52,28.77 38.87,28.77 40.4,30.3 v43.48,30.3
  Bottom 0.305: v43.48,30.3 43.68,30.09 46.56,30.09 46.95,30.49 46.95,32.97 47.72,33.74 48.75,33.74 49.53,32.96 49.53,31.98 50.3,31.21 52.05,31.21 HM3.3 | 28.85,16.62 29.19,16.97 29.19,20.66 30.92,22.38 32.12,22.38 v38.52,28.77 | 28.85,16.62 28.85,16.35 M1.J7.1 | 28.85,16.62 28.5,16.62 RS485.4
GND  (via drill 0.3 pad 0.61)  (2 unrouted)
  Top 0.508: JP1.4 54.48,27.42 54.48,28.13 55.78,29.43 62.76,29.43 NMODULE.9 | REG2.OUT- 36.51,45.25 37.33,45.25 BOOST.2 40.91,40.67 | HM3.1 48.26,32.89 44.23,36.92 44.23,37.58 C2.2 43.04,37.58 41.87,37.58 41.27,38.17 | REG2.IN- 37.69,31.2 39.05,32.55 R2.1 39.05,35.85 39.5,36.3 C4.1 40.68,37.58 41.27,38.17 | 40.91,40.67 40.52,40.28 40.52,38.93 41.27,38.17 | MYSX.4 4.95,10.91 4.95,10.68 6,9.64 v6.6,9.64 | 17.89,17.46 20.11,17.46 v24.17,21.52 | 7.35,42.58 19.88,42.58 20.29,42.99 IC1.3 22.06,42.99 24.18,40.88 26.04,40.88 27.09,39.83 27.09,39.51 27.65,39.51 | 7.35,42.58 7.35,37.5 CC0.GND@1 4.65,37.5 4.45,37.29 4.45,36.46 X5.GND@4 X2.GND@1 X2.GND@3 4.45,31.2 4.45,30.59 M1.J6.2 15.61,19.43 15.61,17.46 M2.GND 17.89,17.46 | 27.65,39.51 29.07,40.93 31.4,40.93 31.64,40.69 v31.64,38.27 | 27.65,39.51 IC2.1 28.22,38.03 29.27,36.98 C6.1 28.14,35.95 28.14,35.59 26.55,34 26.35,34 CC0.GND@0 | 17.89,17.46 17.89,15.71 17.63,15.45 13.43,15.45 M1.J7.9 9.92,11.94 9.92,10.91 | 7.35,42.58 CC0.GND@2 5.35,42.58 4.65,42.58 4.45,42.37 4.45,41.54 X5.GND@3 | 40.91,40.67 41.53,40.67 41.78,40.42 44.38,40.42 46.96,43 U$3.RING 60.16,43 60.82,43.66 BH1750.2 | 9.92,10.91 9.92,10.8 10.96,9.77 11.68,9.77 12.7,8.75 12.7,7.95 15.72,4.93 X1.4 17.72,6.18 22.39,6.18 22.73,5.83 I2C-1.2 | MOTION.2 JP1.3 | MYSX.8 9.92,10.91 | REG1.2 42.43,25.44 42.44,25.44 45.54,22.34 OPT.2 49.41,21.19 51.29,21.19 52.2,22.1 52.2,22.34 JP1.2
  Bottom 0.508: MYSX.8 7.75,10.91 7.75,10.66 6.72,9.64 v6.6,9.64 | v24.17,21.52 24.17,22.2 24.45,22.48 C10.1 | v31.64,38.27 32.61,37.3 C3.- 32.61,29.62 32.88,29.34 32.88,28.4 33.79,27.49 35.21,27.49 36.51,28.79 36.51,30.01 REG2.IN- | REG1.2 41.39,24.39 41.39,19.65 41.91,19.13 I2C-2.2 | HM1.2 53.34,18.66 JP1.1 JP1.2 JP1.3 JP1.4 53.34,28.56 52.2,28.56 HM3.1 | 19.25,16.62 17.78,15.16 17.78,6.24 X1.4 | 19.25,16.62 19.25,17.26 R6.2 | 19.25,16.62 20.93,16.62 RS485.5 | X2.GND@3 4.45,31.2 4.89,31.64 RFM69W.GNDB 7.22,31.64 | M1.J6.2 7.22,29.56 7.22,31.64 | X5.GND@3 X5.GND@4 X2.GND@1 3.48,36.28 4.28,35.48 RFM69W.GNDA 7.22,35.48 7.22,31.64 | I2C-1.2 25.02,5.83 27.46,3.38 28.81,3.38 C1.2
IN
  Bottom 0.508: F1.P$2 41.99,34.48 41.99,34.83 44.26,37.1 U$3.TIP
IRQ  (via drill 0.3 pad 0.61)
  Top 0.305: M1.J7.8 15,14.48 18.96,14.48 25.63,21.15 26.28,21.15 27.12,21.99 27.12,22.55 26.71,22.96 v26.08,22.96 26.02,23.03 22.69,23.03 19.78,25.93 17.6,25.93 M2.IRQ | v25.66,42.87 26.25,43.46 26.25,44 CC0.GDO0 | v60.26,34.87 60.26,38.18 58.62,39.83 56.38,39.83 53.98,37.42 50.59,37.42 48.17,39.83 41.4,39.83 v41.25,39.99 | NMODULE.5 61.86,18.53 v61.77,18.45
  Bottom 0.305: 28.31,21.63 31.56,24.88 33.42,24.88 37.62,29.09 37.62,39.39 37.2,39.81 37.2,42.15 37.86,42.81 38.88,42.81 39.49,42.2 39.49,41.5 41,39.99 v41.25,39.99 | 28.5,19.16 28.5,21.44 28.31,21.63 | 28.31,21.63 26.36,21.63 25.95,22.04 25.95,22.83 v26.08,22.96 30.27,27.15 30.27,39.22 26.4,43.09 25.88,43.09 | 25.88,43.09 v25.66,42.87 | RFM69W.DIO0 25.88,43.39 25.88,43.09 | 28.5,19.16 28.34,19.16 RS485.2 | 28.5,19.16 28.5,17.9 RS485.3 | v61.77,18.45 61.72,18.5 55.7,18.5 54.81,19.39 54.81,20.21 55.66,21.07 56.11,21.07 58.02,22.98 58.02,32.62 v60.26,34.87 | M1.J7.8 13.97,12.41 12.47,10.91 MYSX.10
MISO  (1 unrouted)
  Top 0.305: 23.02,28.31 21.91,27.2 14.78,27.2 14.17,26.59 14.17,25.36 15.71,23.81 M2.MISO | 23.02,28.31 23.02,39.27 23.75,40 CC0.MISO | M1.J6.10 25.61,27.63 23.7,27.63 23.02,28.31
  Bottom 0.305: M1.J6.10 26.23,28.69 12.46,42.46 4.48,42.46 4.38,42.36 4.38,39.64 RFM69W.MISO
MOSI  (via drill 0.3 pad 0.61)  (1 unrouted)
  Top 0.305: v17.78,32.22 17.78,28.47 16.94,27.63 14.58,27.63 13.73,26.79 13.73,24.52 15.71,22.54 M2.MOSI | CC0.MOSI 26.25,36 26.76,35.48 v27.07,35.48
  Bottom 0.305: RFM69W.MOSI 8.35,41.64 v17.78,32.22 22.09,32.22 25.4,28.91 25.4,28.49 26.26,27.64 28.04,27.64 29.09,28.69 | 29.09,28.69 29.09,33.45 v27.07,35.48 | M1.J6.11 29.09,28.69
N$1  (via drill 0.3 pad 0.61)
  Top 0.305: MYSX.1 2.31,8.37 4.32,6.36 9.9,6.36 13.13,3.13 21.76,3.13 23.03,4.41 26.27,4.41 v30.21,8.35
  Bottom 0.305: RAW(MYSX).2 30.21,8.34 v30.21,8.35
N$16  (1 unrouted)
  Bottom 0.305: X2.P 4.34,33.74 4.34,33.52 4.38,33.48 RFM69W.ANT
RESET
  Bottom 0.305: MYSX.7 8.89,9.41 9.94,10.47 9.94,12.4 M1.J7.10
RX
  Bottom 0.305: MYSX.6 M1.J7.11
SCK  (via drill 0.3 pad 0.61)  (1 unrouted)
  Top 0.305: M2.SCK 15.71,21.27 10.39,26.59 10.39,29.12 12.89,31.62 v13.41,31.62 | M1.J6.9 23.75,29.06 23.75,38 CC0.SCLK
  Bottom 0.305: RFM69W.SCK 7.38,37.64 v13.41,31.62 21.2,31.62 M1.J6.9
TX
  Top 0.305: M1.J7.12 2.75,12.39 2.75,10.49 3.61,9.63 5.09,9.63 MYSX.5
UREG  (via drill 0.3 pad 0.61)
  Top 0.508: 57.46,31.23 57.37,31.14 46.89,31.14 46.84,31.2 REG2.IN+ 45.1,31.2 | 45.1,31.2 45.1,30.9 43.81,29.61 43.43,29.61 41.16,27.34 REG1.3 33.94,27.34 33.12,28.16 33.12,37.8 32.79,38.13 IC2.3 32.79,40.89 32.1,41.58 27.8,41.58 v27.43,41.2 | v17.92,38.34 13.69,38.34 v5.92,30.57 | NMODULE.10 57.46,31.23 | 57.46,31.23 57.46,32.82 53.87,36.4 48.21,36.4 47.03,37.58 C2.1 | R1.1 44.13,32.64 45.1,31.66 45.1,31.2
  Bottom 0.508: 37.57,21.47 37.81,21.71 37.81,23.99 40.12,26.3 40.12,26.98 REG1.3 40.12,28.38 40.12,30.37 38.37,32.12 BOOST.1 | 37.57,21.47 37.41,21.31 36.84,21.31 36.82,21.33 35.86,21.33 35.84,21.31 35.44,21.31 33.38,19.25 33.38,12.53 31.68,10.83 RAW(MYSX).1 | 37.57,21.47 40.51,18.53 40.51,17.7 43.57,14.64 50.72,14.64 HM1.1 | 4.68,28.69 M1.J6.1 | X1.1 5.17,5.73 5.17,12.11 5.26,12.2 5.26,12.77 5.17,12.86 5.17,14.23 5.52,14.58 5.52,27.85 4.68,28.69 | v5.92,30.57 4.68,29.33 4.68,28.69 | v17.92,38.34 20.23,40.65 26.87,40.65 v27.43,41.2 | F1.P$1 44.91,32.45 45.59,32.45 45.66,32.38 REG2.IN+
VCC  (via drill 0.3 pad 0.61)
  Top 0.508: 56.45,27.42 57.82,28.79 61.47,28.79 63.5,26.76 NMODULE.8 | v23.1,26.42 23.41,26.73 26.32,26.73 27.86,28.26 | 27.86,28.26 27.86,30.49 27.3,31.05 | 27.86,28.26 28.7,27.42 32.12,27.42 33.29,26.24 40.72,26.24 40.98,26.5 41.82,26.5 REG1.1 43.7,27.34 46.16,24.88 OPT.3 | 27.3,31.05 26.35,32 CC0.VCC | 27.3,31.05 29.27,33.02 C6.2 30.4,34.05 30.5,34.15 IC2.2 | 7.7,7.2 12.44,7.2 15.97,3.67 18.71,3.67 X1.5 | 7.7,7.2 5.88,7.2 4.95,8.13 4.95,8.37 MYSX.3 | v7.79,14.42 7.7,14.34 7.7,7.2 | 56.45,27.42 55.26,26.23 52.9,26.23 | JP3.3 51.94,24.88 51.94,25.28 52.9,26.23 | 52.9,26.23 51.94,27.18 51.94,27.42 JP3.4 | MOTION.1 56.45,27.42
  Bottom 0.508: v23.1,26.42 22.55,25.87 C10.2 22.55,22.48 22.3,22.23 RS485.8 22.25,20.44 20.93,20.44 20.29,21.07 R5.1 18.73,21.13 17.57,22.29 17.46,22.29 13.97,25.79 13.97,26.62 11.9,28.69 M1.J6.4 7.79,25.05 v7.79,14.42 | 57.27,33.08 57.46,33.08 60.82,36.43 60.82,44.2 61.67,45.06 61.96,45.06 BH1750.1 | 22.25,5.84 23.43,7.01 27.99,7.01 28.81,6.19 C1.1 | 22.25,5.84 20.88,5.84 X1.5 19.97,2.59 18.27,0.89 15.56,0.89 R3.1 | 22.25,5.84 23.66,4.43 23.88,4.43 I2C-1.1 | 57.27,33.08 57.27,29.95 55.88,28.56 MOTION.1 | I2C-2.1 44.45,19.13 44.45,21.07 OPT.3 JP3.3 JP3.2 JP3.1 | REG1.1 42.66,28.38 42.66,28.72 39.2,32.18 39.2,36.97 43.45,41.22 BOOST.3 45.66,43.88 REG2.OUT+ | 57.27,33.08 56.48,33.86 52.16,33.86 HM3.2

### Text on the board
Top: Checken
tPlace: Vout | easyMySens V0.1 | by Ranseyer | Gnd | MysX 2.4
tOrigins: G3 | G1 | G1 | G3 | G2 | G3 | G1 | G1 | G3 | Gehäuse 1: Box2252 / Geh2: 59x65 / Gehäuse 3: 67x98
bOrigins: HM | uni / versal
tNames: VCC GND RAW | 4,7uF | I2C | V+ | A4/SDA SCL GND VCC | A5/SCL SDA GND VCC